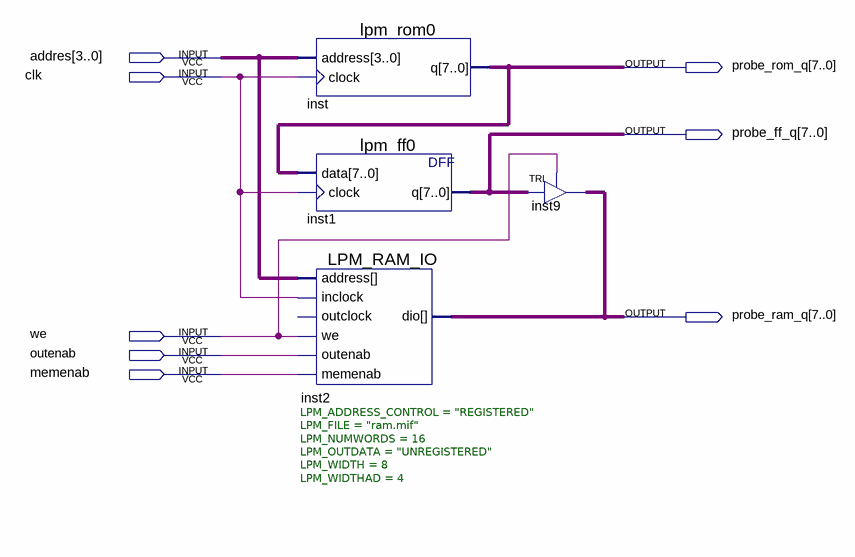
[diagram p0: schematic sheet]
// Quartus schematic rom_ram_interface.bdf as structural Verilog: 4 symbols, 8 pins
module rom_ram_interface (
  input  [3:0] addres,
  input  clk,
  input  we,
  input  outenab,
  input  memenab,
  output [7:0] probe_rom_q,
  output [7:0] probe_ff_q,
  output [7:0] probe_ram_q
);

  lpm_rom0 inst (.address(addres), .clock(clk), .q(probe_rom_q));
  lpm_ff0 inst1 (.data(probe_rom_q), .clock(clk), .q(probe_ff_q));
  LPM_RAM_IO #(.LPM_ADDRESS_CONTROL("REGISTERED"), .LPM_FILE("ram.mif"), .LPM_NUMWORDS(16), .LPM_OUTDATA("UNREGISTERED"), .LPM_WIDTH(8), .LPM_WIDTHAD(4)) inst2 (
    .address(addres), .memenab(memenab), .inclock(clk), .we(we), .outenab(outenab), .dio(probe_ram_q));  // open: outclock
  TRI inst9[7:0] (.IN(probe_ff_q), .OE(we), .OUT(probe_ram_q));
endmodule
